# Altium schematic sheet VMux_Top.SchDoc
size A4; DocumentNumber: 1; SheetNumber: 1; SheetTotal: 5
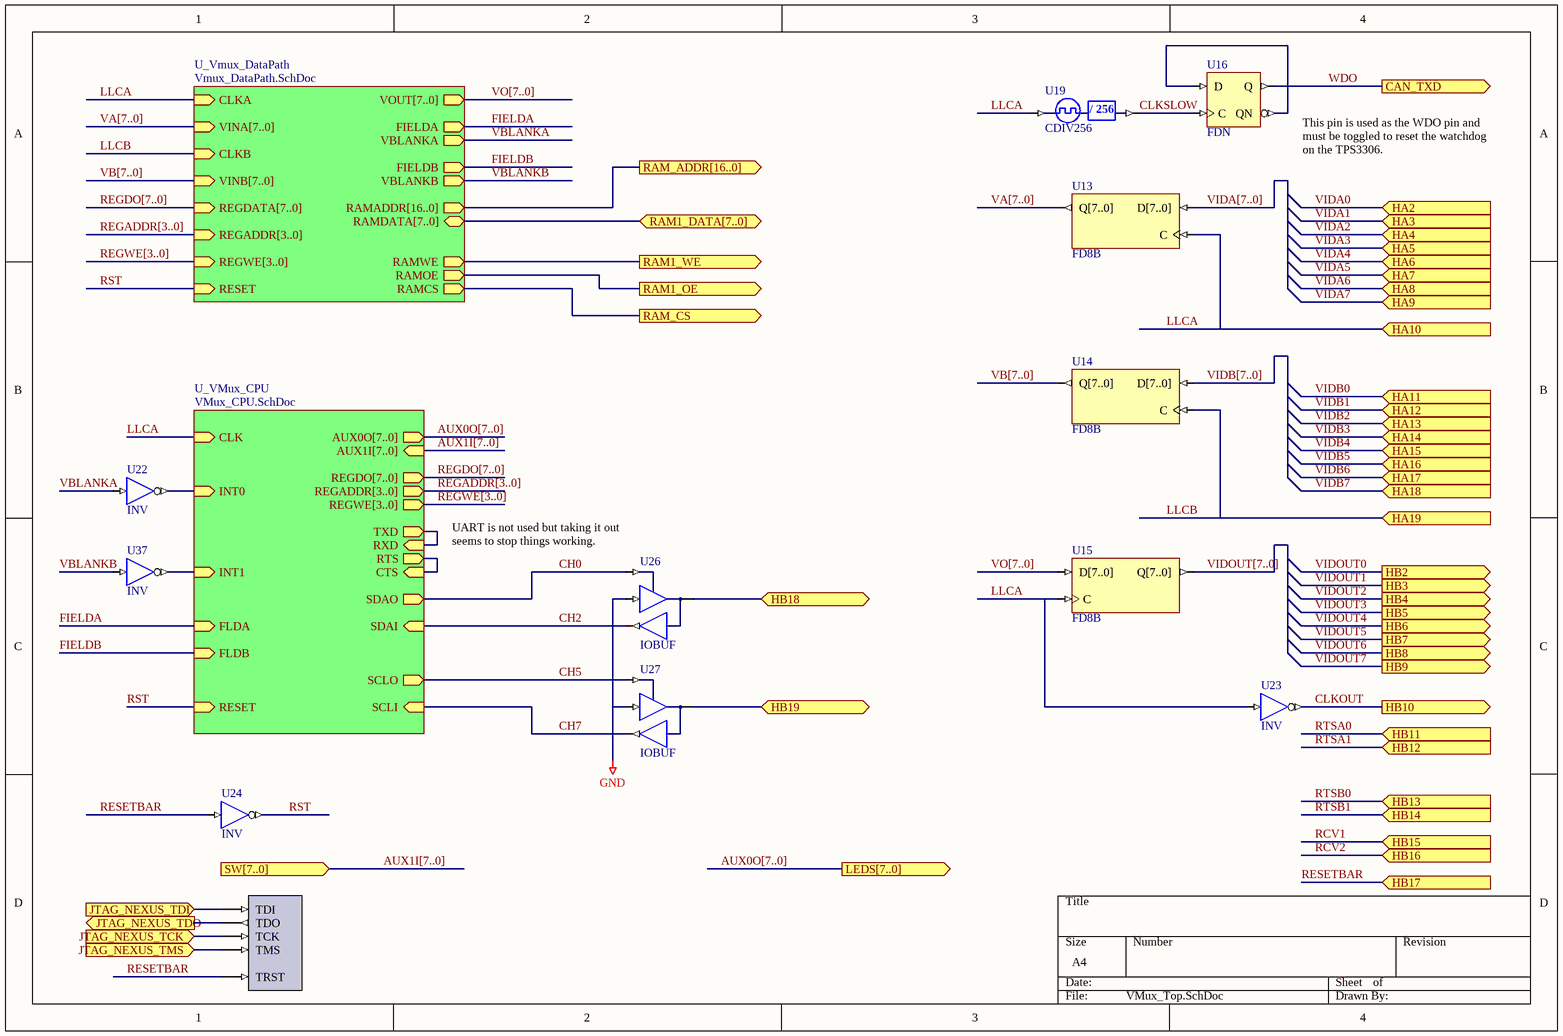
[diagram p0: VMux_Top.SchDoc]

## Parts
NEXUS_JTAG_PORT  NEXUS_JTAG_PORT  (value not drawn)
U13  FD8B
U14  FD8B
U15  FD8B
U16  FDN
U19  CDIV256
U22  INV
U23  INV
U24  INV
U26  IOBUF
U27  IOBUF
U37  INV

## Sub-sheets
U_VMux_CPU = VMux_CPU.SchDoc: CLK (in), RESET (in), SDAO (out), SCLO (out), SDAI (in), SCLI (in), AUX0O[7..0] (out), AUX1I[7..0] (in), RTS (out), TXD (out), CTS (in), RXD (in), REGDO[7..0] (out), REGADDR[3..0] (out), REGWE[3..0] (out), INT0 (in), INT1 (in), FLDA (in), FLDB (in)
U_Vmux_DataPath = Vmux_DataPath.SchDoc: REGADDR[3..0] (in), REGWE[3..0] (in), REGDATA[7..0] (in), VINA[7..0] (in), VINB[7..0] (in), CLKA (in), CLKB (in), RAMADDR[16..0] (out), RAMDATA[7..0] (bidir), RAMCS (out), RAMOE (out), RAMWE (out), VOUT[7..0] (out), RESET (in), VBLANKA (out), VBLANKB (out), FIELDA (out), FIELDB (out)

## Ports
CAN_TXD (out), HA2 (in), HA3 (in), HA4 (in), HA5 (in), HA6 (in), HA7 (in), HA8 (in), HA9 (in), HA10 (in), HA11 (in), HA12 (in), HA13 (in), HA14 (in), HA15 (in), HA16 (in), HA17 (in), HA18 (in), HA19 (in), HB2 (out), HB3 (out), HB4 (out), HB5 (out), HB6 (out), HB7 (out), HB8 (out), HB9 (out), HB10 (out), HB11 (in), HB12 (in), HB13 (in), HB14 (in), HB15 (in), HB16 (in), HB17 (in), HB18 (bidir), HB19 (bidir), JTAG_NEXUS_TCK (in), JTAG_NEXUS_TDI (in), JTAG_NEXUS_TDO (out), JTAG_NEXUS_TMS (in), LEDS[7..0] (out), RAM1_DATA[7..0] (bidir), RAM1_OE (out), RAM1_WE (out), RAM_ADDR[16..0] (out), RAM_CS (out), SW[7..0] (in)

## Nets
GND: U26.I U27.I
CH0: U26.T ; sheet U_VMux_CPU/SDAO
CH2: U26.O ; sheet U_VMux_CPU/SDAI
CH5: U27.T ; sheet U_VMux_CPU/SCLO
CH7: U27.O ; sheet U_VMux_CPU/SCLI
CLKOUT: U23.O ; port HB10
CLKSLOW: U16.C U19.CLKDV
FIELDA: sheet U_VMux_CPU/FLDA, sheet U_Vmux_DataPath/FIELDA
FIELDB: sheet U_VMux_CPU/FLDB, sheet U_Vmux_DataPath/FIELDB
HB18: U26.IO ; port HB18
HB19: U27.IO ; port HB19
JTAG_NEXUS_TCK: NEXUS_JTAG_PORT.TCK ; port JTAG_NEXUS_TCK
JTAG_NEXUS_TDI: NEXUS_JTAG_PORT.TDI ; port JTAG_NEXUS_TDI
JTAG_NEXUS_TDO: NEXUS_JTAG_PORT.TDO ; port JTAG_NEXUS_TDO
JTAG_NEXUS_TMS: NEXUS_JTAG_PORT.TMS ; port JTAG_NEXUS_TMS
LLCA: U13.C U15.C U19.CLKIN U23.I ; port HA10, sheet U_VMux_CPU/CLK, sheet U_Vmux_DataPath/CLKA
LLCB: U14.C ; port HA19, sheet U_Vmux_DataPath/CLKB
RAM1_OE: port RAM1_OE, sheet U_Vmux_DataPath/RAMOE
RAM1_WE: port RAM1_WE, sheet U_Vmux_DataPath/RAMWE
RAM_CS: port RAM_CS, sheet U_Vmux_DataPath/RAMCS
RCV1: port HB15
RCV2: port HB16
RESETBAR: NEXUS_JTAG_PORT.TRST U24.I ; port HB17
RST: U24.O ; sheet U_VMux_CPU/RESET, sheet U_Vmux_DataPath/RESET
RTSA0: port HB11
RTSA1: port HB12
RTSB0: port HB13
RTSB1: port HB14
VA[7..0]: U13.Q[7..0] ; sheet U_Vmux_DataPath/VINA[7..0]
VB[7..0]: U14.Q[7..0] ; sheet U_Vmux_DataPath/VINB[7..0]
VBLANKA: U22.I ; sheet U_Vmux_DataPath/VBLANKA
VBLANKB: U37.I ; sheet U_Vmux_DataPath/VBLANKB
VIDA0: port HA2
VIDA1: port HA3
VIDA2: port HA4
VIDA3: port HA5
VIDA4: port HA6
VIDA5: port HA7
VIDA6: port HA8
VIDA7: port HA9
VIDA[7..0]: U13.D[7..0]
VIDB0: port HA11
VIDB1: port HA12
VIDB2: port HA13
VIDB3: port HA14
VIDB4: port HA15
VIDB5: port HA16
VIDB6: port HA17
VIDB7: port HA18
VIDB[7..0]: U14.D[7..0]
VIDOUT0: port HB2
VIDOUT1: port HB3
VIDOUT2: port HB4
VIDOUT3: port HB5
VIDOUT4: port HB6
VIDOUT5: port HB7
VIDOUT6: port HB8
VIDOUT7: port HB9
VIDOUT[7..0]: U15.Q[7..0]
VO[7..0]: U15.D[7..0] ; sheet U_Vmux_DataPath/VOUT[7..0]
WDO: U16.Q ; port CAN_TXD
NetU16_D: U16.D U16.QN
NetU22_O: U22.O ; sheet U_VMux_CPU/INT0
NetU37_O: U37.O ; sheet U_VMux_CPU/INT1
(unnamed): sheet U_VMux_CPU/RTS, sheet U_VMux_CPU/CTS
(unnamed): sheet U_VMux_CPU/TXD, sheet U_VMux_CPU/RXD

## Buses and harness runs
bus AUX0O[7..0] = port LEDS[7..0]
bus AUX0O[7..0] = sheet U_VMux_CPU/AUX0O[7..0]
bus AUX1I[7..0] = port SW[7..0]
bus AUX1I[7..0] = sheet U_VMux_CPU/AUX1I[7..0]
bus port RAM1_DATA[7..0] = sheet U_Vmux_DataPath/RAMDATA[7..0]
bus port RAM_ADDR[16..0] = sheet U_Vmux_DataPath/RAMADDR[16..0]
bus REGADDR[3..0] = sheet U_VMux_CPU/REGADDR[3..0]
bus REGADDR[3..0] = sheet U_Vmux_DataPath/REGADDR[3..0]
bus REGDO[7..0] = sheet U_VMux_CPU/REGDO[7..0]
bus REGDO[7..0] = sheet U_Vmux_DataPath/REGDATA[7..0]
bus REGWE[3..0] = sheet U_VMux_CPU/REGWE[3..0]
bus REGWE[3..0] = sheet U_Vmux_DataPath/REGWE[3..0]
bus VA[7..0]
bus VA[7..0] = sheet U_Vmux_DataPath/VINA[7..0]
bus VB[7..0]
bus VB[7..0] = sheet U_Vmux_DataPath/VINB[7..0]
bus VIDA[7..0]
bus VIDB[7..0]
bus VIDOUT[7..0]
bus VO[7..0]
bus VO[7..0] = sheet U_Vmux_DataPath/VOUT[7..0]

## Notes on the sheet
- (near U16) This pin is used as the WDO pin and must be toggled to reset the watchdog on the TPS3306.
- (near U26) UART is not used but taking it out seems to stop things working.
- (in symbol CDIV256) / 256

## Library data of the parts
NEXUS_JTAG_PORT = NEXUS_JTAG_PORT: Nexus Processor JTAG Chain Connector; NEXUS_JTAG_CONNECTOR: True; Published: 5-Sep-2003; Publisher: Altium Hobart Technology Centre
U13-U15 = FD8B: 8-Bit D-Type Flip-Flop, Bus Version; Xilinx Equivalent: FD8; ArchiveName: GENERIC; Published: 18-Nov-2003; Publisher: Altium Limited; Core Revision: 1.00.00
U16 = FDN: D-Type Flip-Flop with Inverted and Non-Inverted Outputs; ArchiveName: GENERIC; Published: 18-Nov-2003; Publisher: Altium Limited; Core Revision: 1.00.00
U19 = CDIV256: Clock Divider by 256; ArchiveName: GENERIC; Published: 18-Nov-2003; Publisher: Altium Limited; Core Revision: 1.00.00
U22 U23 U37 = INV: Inverter; ArchiveName: GENERIC; Published: 18-Nov-2003; Publisher: Altium Limited; Xilinx Equivalent: INV; Core Revision: 1.00.00
U24 = INV: Inverter; Class I: Logic Primitive; ArchiveName: GENERIC; Published: 18-Sep-2003; Publisher: Altium Limited; Xilinx Equivalent: INV
U26 U27 = IOBUF: Input/Output Buffer; ArchiveName: GENERIC; Published: 18-Sep-2003; Publisher: Altium Limited; Class I: Buffer; Xilinx Equivalent: IOBUF